# EAGLE design e75-2g4m10s (EAGLE 9.6.2)
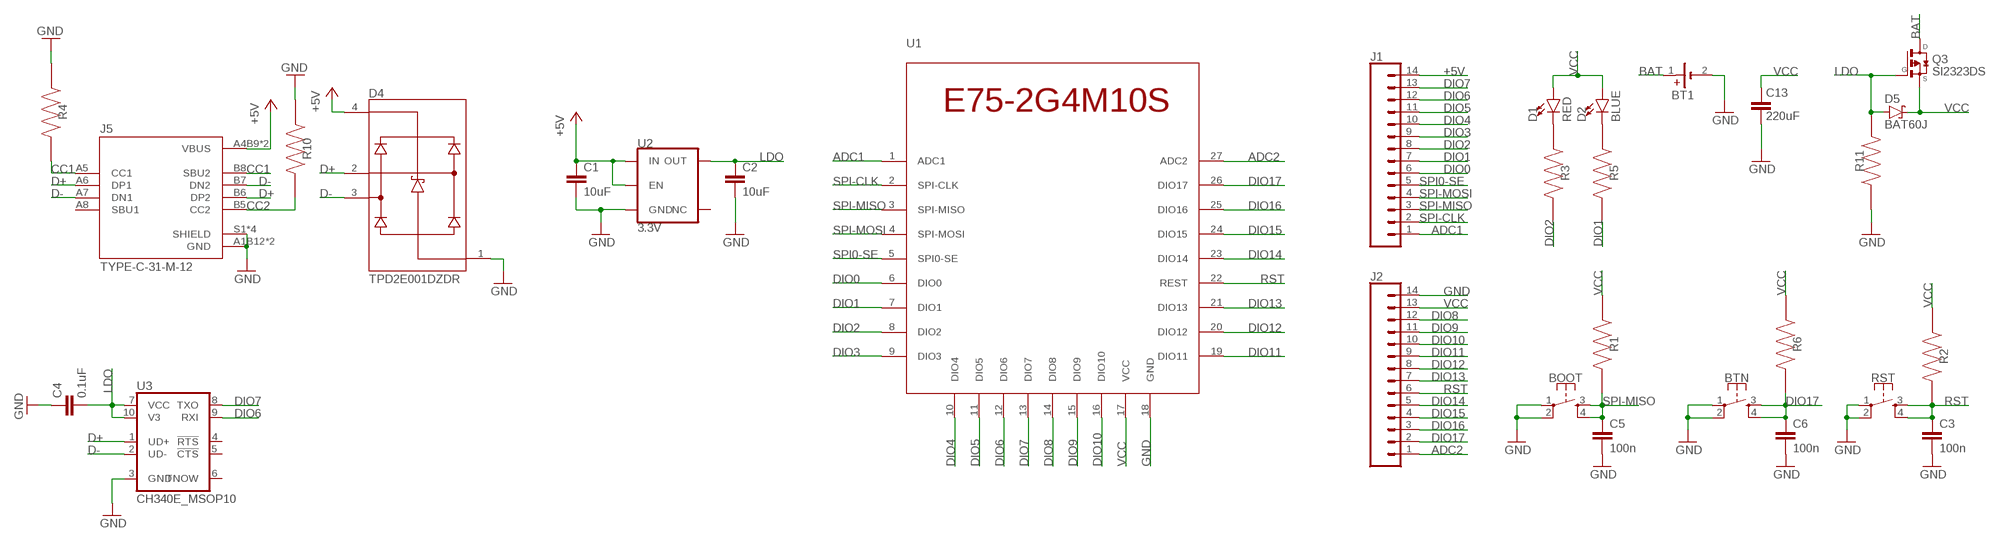
[diagram p0: schematic, sheet 1]

## Parts
BOOT  MOMENTARY-SWITCH-SPST-2-SMD-4.6X2.8MM  [TACTILE_SWITCH_SMD_4.6X2.8MM]
BT1  79527141  [79527141]
BTN  MOMENTARY-SWITCH-SPST-2-SMD-4.6X2.8MM  [TACTILE_SWITCH_SMD_4.6X2.8MM]
C1  10uF  10UF-0603-6.3V-20%  [0603]
C2  10uF  10UF-0603-6.3V-20%  [0603]
C3  100n  0.1UF-0603-25V-5%  [0603]
C4  0.1uF  0.1UF-0603-25V-(+80/-20%)  [0603]
C5  100n  0.1UF-0603-25V-5%  [0603]
C6  100n  0.1UF-0603-25V-5%  [0603]
C13  220uF  C_TANTALUM-2917(7343-METRIC)  [CAPM7343X310]
D1  RED  LED-RED0603  [LED-0603]
D2  BLUE  LED-GREEN0603  [LED-0603]
D4  TPD2E001DZDR  [SOT192P237X122-4N]
D5  BAT60J  [SOD323_ST]
J1  CONN_14NO_SILK  [1X14_NO_SILK]
J2  CONN_14NO_SILK  [1X14_NO_SILK]
J5  TYPE-C-31-M-12  [HRO_TYPE-C-31-M-12]
Q3  SI2323DS  [SOT23]
R1  10k  RC0402FR-073M6L  [RESC1005X40N]
R2  10k  RC0402FR-073M6L  [RESC1005X40N]
R3  2k  RC0402FR-073M6L  [RESC1005X40N]
R4  5.1k  RC0402FR-073M6L  [RESC1005X40N]
R5  2k  RC0402FR-073M6L  [RESC1005X40N]
R6  10k  RC0402FR-073M6L  [RESC1005X40N]
R10  5.1k  RC0402FR-073M6L  [RESC1005X40N]
R11  10k  RC0402FR-073M6L  [RESC1005X40N]
RST  MOMENTARY-SWITCH-SPST-2-SMD-4.6X2.8MM  [TACTILE_SWITCH_SMD_4.6X2.8MM]
U1  E73-2G4M04S1BE75-2G4M10S  [E75-2G4M10S]
U2  3.3V  V_REG_AP2112K-3.3V  [SOT23-5]
U3  CH340E_MSOP10  [MSOP10]

## Nets
+5V: C1.1 D4.4(VCC) J1.14 J5.A4B9(VBUS) J5.B4A9(VBUS) U2.1(IN) U2.3(EN)
ADC1: J1.1 U1.1(ADC1)
ADC2: J2.1 U1.27(ADC2)
BAT: BT1.1(+) Q3.3(D)
CC1: J5.A5(CC1) J5.B8(SBU2) R4.2
CC2: J5.B5(CC2) R10.2
D+: D4.2(IO1) J5.A6(DP1) J5.B6(DP2) U3.1(UD+)
D-: D4.3(IO2) J5.A7(DN1) J5.B7(DN2) U3.2(UD-)
DIO0: J1.6 U1.6(DIO0)
DIO1: J1.7 R5.2 U1.7(DIO1)
DIO2: J1.8 R3.2 U1.8(DIO2)
DIO3: J1.9 U1.9(DIO3)
DIO4: J1.10 U1.10(DIO4)
DIO5: J1.11 U1.11(DIO5)
DIO6: J1.12 U1.12(DIO6) U3.9(RXI)
DIO7: J1.13 U1.13(DIO7) U3.8(TXO)
DIO8: J2.12 U1.14(DIO8)
DIO9: J2.11 U1.15(DIO9)
DIO10: J2.10 U1.16(DIO10)
DIO11: J2.9 U1.19(DIO11)
DIO12: J2.8 U1.20(DIO12)
DIO13: J2.7 U1.21(DIO13)
DIO14: J2.5 U1.23(DIO14)
DIO15: J2.4 U1.24(DIO15)
DIO16: J2.3 U1.25(DIO16)
DIO17: BTN.3 BTN.4 C6.1 J2.2 R6.2 U1.26(DIO17)
GND: BOOT.1 BOOT.2 BT1.2(-) BTN.1 BTN.2 C1.2 C2.2 C3.2 C4.1 C5.2 C6.2 C13.2 D4.1(GND) J2.14 J5.A1B12(GND) J5.B1A12(GND) J5.S1(SHIELD) J5.S2(SHIELD) J5.S3(SHIELD) J5.S4(SHIELD) R4.1 R10.1 R11.1 RST.1 RST.2 U1.18(GND) U2.2(GND) U3.3(GND)
LDO: C2.1 C4.2 D5.A Q3.1(G) R11.2 U2.5(OUT) U3.7(VCC) U3.10(V3)
N$1: D1.C R3.1
N$4: D2.C R5.1
RST: C3.1 J2.6 R2.2 RST.3 RST.4 U1.22(REST)
SPI0-SE: J1.5 U1.5(SPI0-SE)
SPI-CLK: J1.2 U1.2(SPI-CLK)
SPI-MISO: BOOT.3 BOOT.4 C5.1 J1.3 R1.2 U1.3(SPI-MISO)
SPI-MOSI: J1.4 U1.4(SPI-MOSI)
VCC: C13.1 D1.A D2.A D5.C J2.13 Q3.2(S) R1.1 R2.1 R6.1 U1.17(VCC)
Unconnected: J5.A8(SBU1) U2.4(NC) U3.4(!RTS) U3.5(!CTS) U3.6(TNOW)

## Library data of the parts
BOOT BTN RST = SparkFun-Switches:MOMENTARY-SWITCH-SPST-2: Momentary Switch (Pushbutton) - SPST - Two Circuits Normally-open (NO) SPST momentary switches (buttons, pushbuttons). Schematic symbol includes two switch circuits. Variants SMD-4.6MMX2.8MM - 4.60mm x 2.80mm Tactile Momentary Button Switch - Used on SparkFun SAMD21 Mini Breakout <https://www.sparkfun.com/products/13664> SMD-5.2MM - Mini Pushbutton Switch - SMD <https://www.sparkfun.com/products/8720> - Used on Arduino Pro Mini <https://www.sparkfun.com/products/11114>; PROD_ID: SWCH-13065
BT1 = Battery Holder_2:79527141: BATTERY HOLDER COIN 20MM SMD Manufacturer's datasheet <https://katalog.we-online.de/em/datasheet/79527141.pdf>; CREATED_BY: PCBLayout.com; DIGIKEY_PART_NO: 732-12325-2-ND; MANUFACTURER: Wurth Electronics Inc.; MPN: 79527141
C1 C2 = SparkFun-Capacitors:10UF: 10.0µF ceramic capacitors A capacitor is a passive two-terminal electrical component used to store electrical energy temporarily in an electric field.; PROD_ID: CAP-11015
C3 C5 C6 = SparkFun-Capacitors:0.1UF: 0.1µF ceramic capacitors A capacitor is a passive two-terminal electrical component used to store electrical energy temporarily in an electric field.; PROD_ID: CAP-08604; VALUE: 0.1uF
C4 = SparkFun-Capacitors:0.1UF: 0.1µF ceramic capacitors A capacitor is a passive two-terminal electrical component used to store electrical energy temporarily in an electric field.; PROD_ID: CAP-00810
C13 = Capacitor:C: Capacitor - Generic; CATEGORY: Capacitor
D1 = SparkFun-LED:LED-RED: Red SMD LED Used in manufacturing of most products at SparkFun Packages: 0603 - SMD 0603 package [Product Link] <http://docs.avagotech.com/docs/AV02-0551EN> 0603 SMART - SMD 0603 SMART package ( more efficient and expensive)[Product Link] <http://www.osram-os.com/Graphics/XPic2/00077099_0.pdf> 1206 - SMD1206 package [Product Link] <https://www.sparkfun.com/datasheets/DevTools/LilyPad/Q150OVS4.pdff> SparkFun Products: Pro Mini 328 -5V <https://www.sparkfun.com/products/821> RedBoard <https://www.sparkfun.com/products/12757> IOIO-OTG <https://www.sparkfun.com/products/13613>; PROD_ID: DIO-00819
D2 = SparkFun-LED:LED-GREEN: Green SMD LED Used in manufacturing of various products at SparkFun Packages: 0603 - SMD 0603 package [Product Link] <http://www.futureelectronics.com/en/technologies/semiconductors/optoelectronics/leds/Pages/9894312-LTST-C190GKT.aspx?CrossPart=HSMG-C190&IM=0> LilyPad 1206 - SMD1206 LilyPad package [Product Link] <http://www.futureelectronics.com/en/Technologies/Product.aspx?ProductID=IN150NGHARVATEKCORPORATION2049943&IM=0> 1206 - SMD1206 package [Product Link] <http://www.futureelectronics.com/en/technologies/semiconductors/optoelectronics/leds/Pages/8315665-LTST-C150KGKT.aspx?IM=0> 1206 Bottom Mount -SMD 1206 Bottom Mount [Product Link] <http://www.digikey.com/product-detail/en/lite-on-inc/LTST-C230KGKT/160-1456-1-ND/386854> SparkFun Products: Pro Mini 328 -5V <https://www.sparkfun.com/products/821> RedBoard <https://www.sparkfun.com/products/12757> MP3 Trigger <https://www.sparkfun.com/products/13720> Makey Makey <https://www.sparkfun.com/products/11076>; PROD_ID: DIO-00821; VALUE: GREEN
D4 = TPD2E001DZDR:TPD2E001DZDR: Low-capacitance 2-channel +/-15k-V ESD protection array for high-speed data interfaces Check prices <https://pricing.snapeda.com/parts/TPD2E001DZDR/Texas%20Instruments/view-part?ref=eda>; AVAILABILITY: In Stock; DESCRIPTION: Low-capacitance 2-channel +/-15k-V ESD protection array for high-speed data interfaces 4-SOT-23 -40 to 85; MF: Texas Instruments; MP: TPD2E001DZDR; PACKAGE: SOT-23-4 Texas Instruments; PRICE: None; PURCHASE-URL: https://pricing.snapeda.com/search/part/TPD2E001DZDR/?ref=eda
D5 = diode:BAT60J: Schottky barrier diode Source: www.st.com, BAT60J.pdf
J1 J2 = SparkFun-Connectors:CONN_14: Multi connection point. Often used as Generic Header-pin footprint for 0.1 inch spaced/style header connections On any of the 0.1 inch spaced packages, you can populate with these: Break Away Headers - Straight <https://www.sparkfun.com/products/116> (PRT-00116) Break Away Male Headers - Right Angle <https://www.sparkfun.com/products/553> (PRT-00553) Female Headers <https://www.sparkfun.com/products/115> (PRT-00115) Break Away Headers - Machine Pin <https://www.sparkfun.com/products/117> (PRT-00117) Break Away Female Headers - Swiss Machine Pin <https://www.sparkfun.com/products/743> (PRT-00743) For SCREWTERMINALS and SPRING TERMINALS visit here: Screw Terimnals on SparkFun.com <https://www.sparkfun.com/search/results?term=Screw+Terminals> (5mm/3.5mm/2.54mm spacing) This device is also useful as a general connection point to wire up your design to another part of your project. Our various solder wires solder well into these plated through hole pads. Hook-Up Wire - Assortment (Stranded, 22 AWG) <https://www.sparkfun.com/products/11375> (PRT-11375) Hook-Up Wire - Assortment (Solid Core, 22 AWG) <https://www.sparkfun.com/products/11367> (PRT-11367) View the entire wire category on our website here <https://www.sparkfun.com/categories/141> Special notes: Molex polarized connector foot print use with SKU : PRT-08231 with associated crimp pins and housings. 1MM SMD Version SKU: PRT-10208 NOTES ON THE VARIANTS LOCK and LOCK_LONGPADS... This footprint was designed to help hold the alignment of a through-hole component (i.e. 6-pin header) while soldering it into place. You may notice that each hole has been shifted either up or down by 0.005 of an inch from it's more standard position (which is a perfectly straight line). This slight alteration caused the pins (the squares in the middle) to touch the edges of the holes. Because they are alternating, it causes a "brace" to hold the component in place. 0.005 has proven to be the perfect amount of "off-center" position when using our standard breakaway headers. Although looks a little odd when you look at the bare footprint, once you have a header in there, the alteration is very hard to notice. Also,if you push a header all the way into place, it is covered up entirely on the bottom side.
J5 = TYPE-C-31-M-12:TYPE-C-31-M-12: USB Connectors 24 Receptacle 1 8.94*7.3mm RoHS; AVAILABILITY: Unavailable; DESCRIPTION: USB Connectors 24 Receptacle 1 8.94*7.3mm RoHS; MF: HRO Electronics Co., Ltd.; MP: TYPE-C-31-M-12; PACKAGE: Package; PRICE: None
Q3 = SI2323DS:SI2323DS: P-Channel MOSFET; AVAILABILITY: Unavailable; DESCRIPTION: P-Channel 20V 3.7A (Ta) 750mW (Ta) Surface Mount SOT-23-3 (TO-236); MF: Vishay Siliconix; MP: SI2323DS; PACKAGE: SOT-23-3 Vishay Siliconix; PRICE: None
R1-R6 R10 R11 = RC0402FR-073M6L:RC0402FR-073M6L: RESISTOR, 0402 0.063W 1% 3M6; Resistance:3.6Mohm; Resistance Tolerance:± 1%; Power Rating:0.063W; Voltage Rating:50V; Series:RC32H; Temperature Coefficient:± 100ppm/°C; Resistor Element Type:Thick Film; Resistor Case Style:0402; No. of Pins:2; SVHC:No SVHC; Case Style:0402; External Length / Height:1mm; Temperature Coeff. +:100ppm/°C; Temperature Coeff. -:100ppm/°C; External Depth:0.35mm; External Width:0.5mm; Operating Temperature Range:-55°C to +155°C; Overload Voltage:100V Check prices <https://pricing.snapeda.com/parts/RC0402FR-073M6L/Yageo/view-part?ref=eda>; AVAILABILITY: Good; DESCRIPTION: RESISTOR, 0402 0.063W 1% 3M6; Resistance:3.6Mohm; Resistance Tolerance:± 1%; Power Rating:0.063W; Voltage Rating:50V; Series:RC32H; Temperature Coefficient:± 100ppm/°C; Resistor Element Type:Thick Film; Resistor Case Style:0402; No. of Pins:2; SVHC:No SVHC; Case Style:0402; External Length / Height:1mm; Temperature Coeff. +:100ppm/°C; Temperature Coeff. -:100ppm/°C; External Depth:0.35mm; External Width:0.5mm; Operating Temperature Range:-55°C to +155°C; Overload Voltage:100V; MF: Yageo; MP: RC0402FR-073M6L; PACKAGE: 1005 Panasonic Electronic Components; PRICE: None; PURCHASE-URL: https://pricing.snapeda.com/search/part/RC0402FR-073M6L/?ref=eda
U1 = E75-2G4M10S:E73-2G4M04S1B
U2 = SparkFun-IC-Power:V_REG_AP2112: AP2112 - 600mA CMOS LDO Regulator w/ Enable The AP2112 is CMOS process low dropout linear regulator with enable function, the regulator delivers a guaranteed 600mA (min.) continuous load current. Features Output Voltage Accuracy: ±1.5% Output Current: 600mA (Min.) Foldback Short Current Protection: 50mA Enable Function to Turn ON/OFF VOUT Low Dropout Voltage (3.3V): 250mV (Typ.) @IOUT=600mA Excellent Load Regulation: 0.2%/A (Typ.) Excellent Line Regulation: 0.02%/V (Typ.) Low Quiescent Current: 55μA (Typ.) Low Standby Current: 0.01μA (Typ.) Low Output Noise: 50μVRMS PSRR: 100Hz -65dB, 1kHz -65dB OTSD Protection Stable with 1.0μF Flexible Cap: Ceramic, Tantalum and Aluminum Electrolytic Operation Temperature Range: -40°C to 85°C ESD: MM 400V, HBM 4000V; PROD_ID: VREG-12457
U3 = CH340E:CH340E: Check prices <https://pricing.snapeda.com/parts/CH340E/WCH/view-part?ref=eda>; AVAILABILITY: Not in stock; DESCRIPTION: USB to serial chip CH340; MF: WCH; MP: CH340E; PACKAGE: Package; PRICE: None

## Net classes
0 default: clearance 0.205 mm

## Board
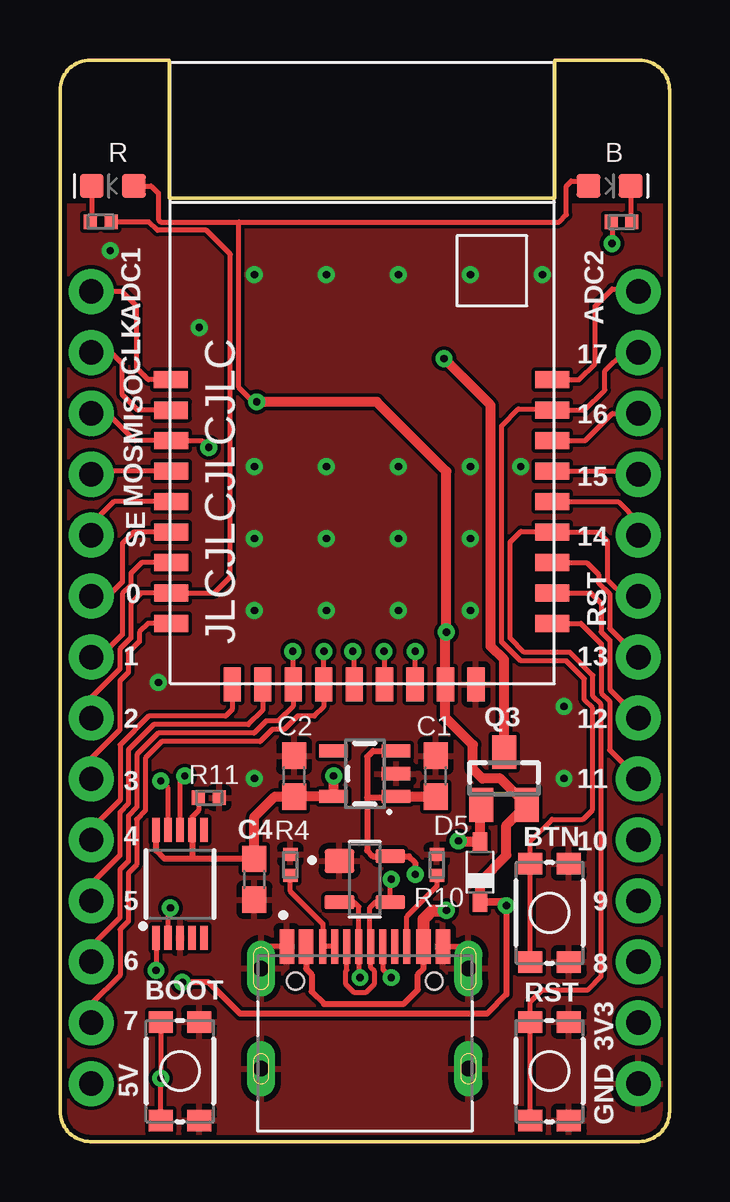
[diagram p1: board, top side]
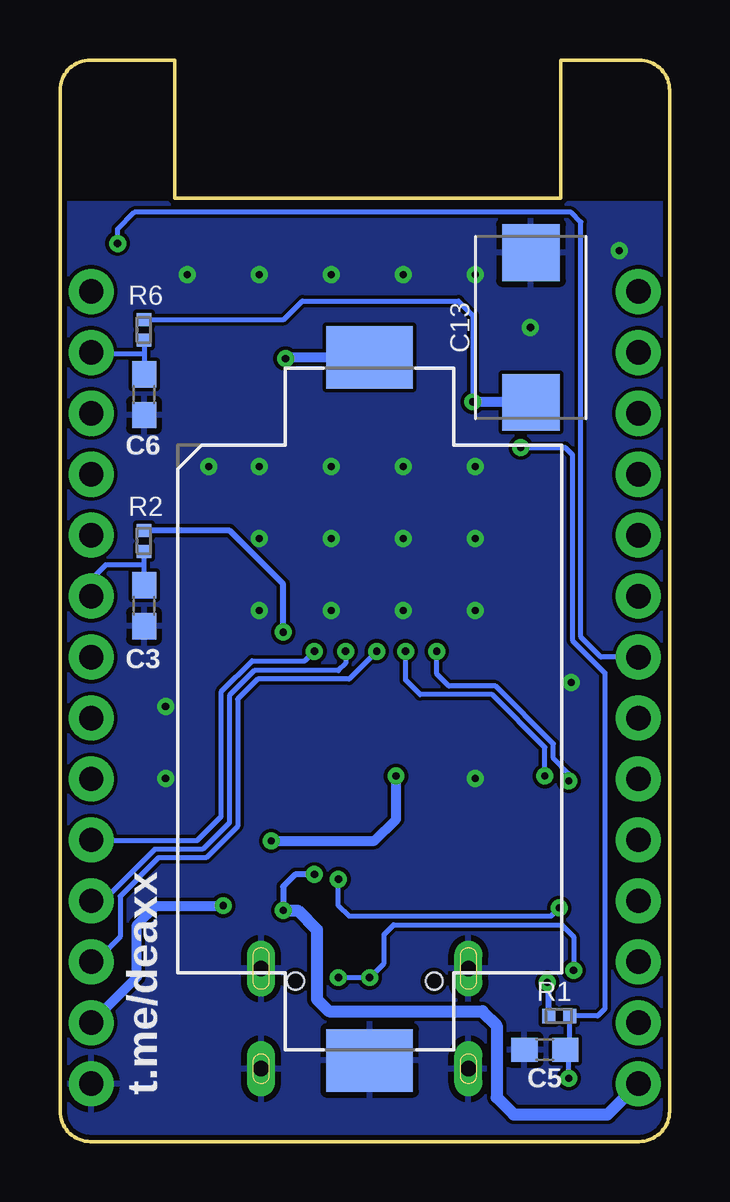
[diagram p2: board, bottom side, seen from below]

Size 25.4 x 45.09 mm. Coordinates in mm from the lower left corner, seen from the top.
Outline: 25.4,1.27 25.4,43.82 arc90 24.13,45.09 20.62,45.09 20.62,39.34 4.54,39.34 4.54,45.09 1.27,45.09 arc90 0,43.82 0,1.27 arc90 1.27,0 24.13,0 arc90 25.4,1.27
Copper layers (1*16): Top 0.035mm / dielectric 1.5mm / Bottom 0.035mm
Design rules "default *": minimum track width 0.2mm, minimum drill 0.3mm, track to track 6mil, track to pad 6mil, pad to pad 6mil, via to via 6mil, smd to smd 6mil, copper to edge 0.2mm, drill to drill 0.3mm, minimum pad ring 10mil, minimum via ring 8mil, stop-mask expansion 4mil, vias tented up to drill 0.3mm, thermal gap 10mil

### Footprints (pad centres in the part's own frame; a part is rotated, then mirrored left to right if it is on the bottom)
TACTILE_SWITCH_SMD_4.6X2.8MM = smd 0.9 x 1: 1 -2.05,-0.8; 2 2.05,-0.8; 3 2.05,0.8; 4 -2.05,0.8
79527141 = smd 2.6 x 3.6: 1 -14.65,0; 2 14.65,0
0603 = smd 1.1 x 1: 1 -0.85,0; 2 0.85,0
CAPM7343X310 = smd 2.368 x 2.404: 1 -3.121,0; 2 3.121,0
LED-0603 = smd 1 x 1: A -0.877,0; C 0.877,0
SOT192P237X122-4N = smd 1.24 x 0.99: 1 -1.055,0.76 | smd 1.24 x 0.59: 2 -1.055,-0.96; 3 1.055,-0.96; 4 1.055,0.96
SOD323_ST = smd 0.8 x 0.6: A 1.25,0; C -1.25,0
1X14_NO_SILK = drill 1.016 pad 1.88: 1 0,0; 2 2.54,0; 3 5.08,0; 4 7.62,0; 5 10.16,0; 6 12.7,0; 7 15.24,0; 8 17.78,0; 9 20.32,0; 10 22.86,0; 11 25.4,0; 12 27.94,0; 13 30.48,0; 14 33.02,0
HRO_TYPE-C-31-M-12 = smd 0.6 x 1.45: A1B12 -3.25,5.095; A4B9 -2.45,5.095; B1A12 3.25,5.095; B4A9 2.45,5.095 | smd 0.3 x 1.45: A5 -1.25,5.095; A6 -0.25,5.095; A7 0.25,5.095; A8 1.25,5.095; B5 1.75,5.095; B6 0.75,5.095; B7 -0.75,5.095; B8 -1.75,5.095 | drill 0.65 pad 1.05 long: S1 -4.32,4.18; S2 4.32,4.18; S3 -4.32,0; S4 4.32,0 | hole 0.7: -2.89,3.65; 2.89,3.65
SOT23 = smd 1 x 1.4: 1 -0.95,-1.1; 2 0.95,-1.1; 3 0,1.1
RESC1005X40N = smd 0.54 x 0.6: 1 -0.432,0; 2 0.432,0
E75-2G4M10S = smd 1.422 x 0.711: 1 -7.988,0.222; 2 -7.968,-1.048; 3 -7.968,-2.318; 4 -7.968,-3.588; 5 -7.968,-4.858; 6 -7.968,-6.128; 7 -7.968,-7.398; 8 -7.968,-8.668; 9 -7.968,-9.938; 19 7.907,-9.938; 20 7.907,-8.668; 21 7.907,-7.398; 22 7.907,-6.128; 23 7.907,-4.858; 24 7.907,-3.588; 25 7.907,-2.318; 26 7.907,-1.048; 27 7.907,0.222 | smd 0.711 x 1.422: 10 -5.428,-12.478; 11 -4.158,-12.478; 12 -2.888,-12.478; 13 -1.618,-12.478; 14 -0.348,-12.478; 15 0.922,-12.478; 16 2.192,-12.478; 17 3.462,-12.478; 18 4.732,-12.478
SOT23-5 = smd 0.55 x 1.2: 1 -0.95,-1.3; 2 0,-1.3; 3 0.95,-1.3; 4 0.95,1.3; 5 -0.95,1.3
MSOP10 = smd 1 x 0.3: 1 -2.25,1; 2 -2.25,0.5; 3 -2.25,0; 4 -2.25,-0.5; 5 -2.25,-1; 6 2.25,-1; 7 2.25,-0.5; 8 2.25,0; 9 2.25,0.5; 10 2.25,1

### Placement (x,y rotation side)
BOOT  5,2.94 90 top
BT1  12.5,18.04 270 bottom
BTN  20.4,9.54 90 top
C1  15.65,15.24 90 top
C2  9.75,15.24 90 top
C3  21.9,22.33 270 bottom
C4  8.1,10.94 90 top
C5  5.2,3.83 180 bottom
C6  21.9,31.13 270 bottom
C13  5.78,33.94 90 bottom
D1  2.2,39.84 180 top
D2  22.9,39.84 0 top
D4  12.7,10.94 0 top
D5  17.5,11.24 90 top
J1  1.3,35.44 270 top
J2  24.1,35.44 270 top
J5  12.7,3.04 0 top
Q3  18.5,15.13 0 top
R1  4.6,5.23 0 bottom
R2  21.9,25.04 270 bottom
R3  1.7,38.34 0 top
R4  9.6,11.54 270 top
R5  23.4,38.34 180 top
R6  21.9,33.84 270 bottom
R10  15.7,11.54 270 top
R11  6.2,14.34 180 top
RST  20.4,2.94 90 top
U1  12.6,31.54 0 top
U2  12.7,15.34 90 top
U3  5,10.74 90 top

### Tracks (layer width: path | path; a pad name or v marks a point on that pad's centre or on a via)
+5V  (via drill 0.3)
  Top 0.254: J5.A4B9 10.25,7.2 10.49,6.96 10.49,6.25 11,5.73 14.31,5.73 14.91,6.33 14.91,6.96 15.15,7.2 J5.B4A9 | U2.3 13.05,16.29 12.8,16.04 12.8,14.34 | 12.8,14.34 12.8,12.13 13.04,11.9 D4.4 14.54,11.9 14.8,11.63 v14.8,11.13 | U2.1 13.95,14.34 12.8,14.34
  Top 0.406: U2.1 C1.1
  Top 0.508: J5.B4A9 15.15,9.28 15.3,9.43 15.31,9.43 15.52,9.63 v16.1,9.63
  Bottom 0.254: v14.8,11.13 15.6,11.13 16.1,10.63 v16.1,9.63
  Bottom 0.508: v16.1,9.63 15.5,9.63 14.7,8.84 14.7,5.93 14.2,5.43 7.8,5.43 7.21,4.84 7.21,1.84 6.5,1.14 2.58,1.14 J1.14
ADC1
  Top 0.2: U1.1 3.68,31.76 3.2,32.23 3.2,34.84 2.6,35.44 J1.1
ADC2
  Top 0.2: J2.1 24,35.54 23,35.54 22.3,34.84 22.3,32.44 21.62,31.76 U1.27
BAT  (via drill 0.3)
  Top 0.406: Q3.3 18.5,20.09 17.94,20.65 17.94,30.69 v16,32.64
  Bottom 0.406: BT1.1 15.95,32.69 v16,32.64
CC1
  Top 0.2: J5.A5 J5.B8 10.95,9.09 9.6,10.44 R4.2
CC2
  Top 0.2: J5.B5 14.45,9.38 15.7,10.63 R10.2
D+  (via drill 0.3)
  Top 0.2: v12.5,6.83 12.45,6.88 J5.A6 12.45,9.79 12.26,9.97 D4.2 | J5.B6 13.46,8.12 13.46,7.18 v13.8,6.83 | U3.1 v4,7.13
  Bottom 0.2: v13.8,6.83 v12.5,6.83 11.9,7.43 11.9,8.63 11.5,9.04 4.5,9.04 4,8.54 v4,7.13
D-  (via drill 0.3)
  Top 0.2: J5.B7 11.95,7.14 11.89,7.09 11.89,6.58 12.25,6.23 12.75,6.23 13.11,6.58 13.11,7.09 12.95,7.24 J5.A7 12.9,8.18 12.9,9.74 13.14,9.97 D4.3 13.75,10.89 v13.8,10.94 | U3.2 4.5,9.63 v4.6,9.74
  Bottom 0.2: v4.6,9.74 4.95,9.39 13.35,9.39 13.8,9.84 v13.8,10.94
DIO0
  Top 0.2: U1.6 3.07,25.41 2.6,24.93 2.6,23.33 2,22.73 J1.6
DIO1  (via drill 0.3)
  Top 0.2: U1.7 3.4,24.14 2.95,23.69 2.95,23.19 2.6,22.84 2.6,21.13 1.66,20.2 J1.7 | R5.2 23,38.3 v23,37.44
  Bottom 0.2: J1.7 2.86,20.2 3.7,21.04 3.7,38.34 4.1,38.73 22.3,38.73 23,38.04 v23,37.44
DIO2
  Top 0.2: J1.8 1.3,18.51 2.49,19.7 2.49,20.53 2.95,20.99 2.95,22.43 3.38,22.87 U1.8 6.43,22.87 7.1,23.54 7.1,36.98 6.1,37.98 4.05,37.98 3.7,38.34 R3.2
DIO3
  Top 0.2: U1.9 3.67,21.6 3.31,21.23 3.31,20.84 2.85,20.38 2.85,19.55 2.49,19.2 2.49,17.16 1.3,15.97 J1.9
DIO4
  Top 0.2: U1.10 7.17,18.01 6.9,17.73 3.7,17.73 2.5,16.54 2.5,14.24 1.3,13.04 J1.10
DIO5
  Top 0.2: U1.11 8.44,17.98 7.85,17.38 3.9,17.38 2.85,16.33 2.85,14.09 2.49,13.73 2.49,11.93 1.3,10.74 J1.11
DIO6  (via drill 0.3)
  Top 0.2: J1.12 1.3,8.13 2.49,9.33 2.49,11.33 2.85,11.68 2.85,13.58 3.21,13.94 3.21,16.13 4.1,17.03 8.09,17.03 8.6,17.54 9.1,17.54 9.71,18.15 U1.12 9.71,20.42 v9.7,20.43 | U3.9 4.5,14.74 v4.2,15.04
  Bottom 0.2: v4.2,15.04 4.2,15.34 4.85,15.98 4.85,16.58 7.25,18.99 9.2,18.99 9.7,19.49 v9.7,20.43
DIO7  (via drill 0.3)
  Top 0.2: J1.13 1.3,5.73 2.5,6.93 2.5,8.84 2.85,9.18 2.85,11.18 3.2,11.53 3.2,13.44 3.56,13.8 3.56,15.99 4.25,16.68 8.34,16.68 8.84,17.18 9.35,17.18 9.9,17.73 10.6,17.73 10.98,18.12 U1.13 10.98,20.42 v11,20.43 | U3.8 5,15.04 v5.2,15.24
  Bottom 0.2: v5.2,15.24 5.2,16.43 7.4,18.63 10.4,18.63 11,19.23 v11,20.43
DIO8  (via drill 0.3)
  Top 0.2: U1.14 12.25,20.38 v12.2,20.43
  Bottom 0.2: v12.2,20.43 13.35,19.28 17.16,19.28 18,18.44 18,13.14 19.31,11.83 21.3,11.83 22.9,10.23 22.9,8.54 23.94,7.49 J2.12
DIO9  (via drill 0.3)
  Top 0.2: U1.15 13.52,20.41 v13.5,20.43
  Bottom 0.2: v13.5,20.43 13.5,19.93 13.8,19.63 17.3,19.63 18.35,18.59 18.35,13.29 19.45,12.18 21.45,12.18 23.6,10.04 J2.11
DIO10  (via drill 0.3)
  Top 0.2: U1.16 v14.79,20.43 v14.8,20.43
  Bottom 0.2: v14.8,20.43 15.2,20.04 17.4,20.04 18.7,18.73 18.7,13.54 19.7,12.54 24.06,12.54 J2.10
DIO11
  Top 0.2: U1.19 21.7,21.6 22.55,20.74 22.55,18.7 22.9,18.36 22.9,16.31 J2.9
DIO12
  Top 0.2: U1.20 22.12,22.87 22.55,22.43 22.55,21.25 22.91,20.89 22.91,18.85 J2.8
DIO13
  Top 0.2: U1.21 21.95,24.14 22.45,23.63 22.45,23.29 22.9,22.84 22.9,21.39 J2.7
DIO14
  Top 0.2: U1.23 23.26,26.68 24.1,25.83 J2.5
DIO15
  Top 0.2: U1.24 23.97,27.95 J2.4
DIO16
  Top 0.2: U1.25 21.88,29.22 23.02,30.36 J2.3
DIO17
  Top 0.2: U1.26 20.7,30.49 | 20.7,30.49 21.85,30.49 22.7,31.33 22.7,32.14 23.46,32.9 J2.2 | 20.7,30.49 20.65,30.54 19.1,30.54 18.4,29.83 18.4,20.83 19.2,20.04 21.1,20.04 21.85,19.29 21.85,18.41 22.2,18.06 22.2,13.83 21.8,13.44 20.5,13.44 19.6,12.54 BTN.3 BTN.4
  Bottom 0.2: R6.2 21.9,32.84 | 21.9,32.84 C6.1 | 21.9,32.84 24.04,32.84 J2.2
GND  (via drill 0.3)
  Top 0.2: J5.B1A12 16.8,8.13 17.02,7.92 J5.S2 | J5.A1B12 8.69,8.13 8.3,7.73 8.3,7.29 J5.S1
  Top 0.406: J5.A1B12
  other vias: 8.1,28.13 14.1,28.13 11.1,28.13 8.1,25.13 8.1,22.13 11.1,25.13 11.1,22.13 14.1,25.13 14.1,22.13 8.1,36.14 11.1,36.14 14.1,36.14 17.1,36.14 20.1,36.14 21,18.13 21,15.13 8.1,15.13 4.1,19.13 2.1,37.14 5.8,33.94 19.2,28.13 17.1,22.13 17.1,25.13 17.1,28.13
  pour Top: -0.2,39.04 -0.2,-0.67 25.9,-0.67 25.9,39.04
  pour Bottom: -0.4,39.14 -0.4,-0.47 25.7,-0.47 25.7,39.14
LDO  (via drill 0.3)
  Top 0.2: U3.7 5.5,13.54 5.8,13.84 5.8,14.3 R11.2
  Top 0.254: C4.2 5.5,11.79 | 5.5,11.79 4.35,11.79 4,12.13 U3.10 | U3.7 5.5,11.79
  Top 0.406: Q3.1 17.5,13.99 D5.A 16.65,12.49 v16.6,12.54 | C4.2 8.1,13.54 8.95,14.38 C2.1 U2.5 v11.4,15.24 | v11.4,15.24
  Bottom 0.406: v16.6,12.54 12.3,12.54 11.4,13.44 v11.4,15.24
N$1
  Top 0.2: R3.1 1.32,38.39 D1.C
N$4
  Top 0.2: D2.C 23.78,38.39 R5.1
RST
  Top 0.2: U1.22 20.6,25.41 | 20.6,25.41 22.43,25.41 22.8,25.04 22.8,23.43 23.5,22.73 J2.6 | RST.4 RST.3 19.6,5.83 20.1,6.33 22,6.33 22.55,6.88 22.55,18.21 22.2,18.55 22.2,19.43 21.25,20.39 19.35,20.39 18.75,20.98 18.75,24.99 19.2,25.43 20.57,25.43 20.6,25.41
  Bottom 0.2: C3.1 21.9,24.04 | 21.9,24.04 R2.2 | 21.9,24.04 23.5,24.04 24.1,23.43 J2.6
SPI0-SE
  Top 0.2: U1.5 2.24,26.68 1.3,25.73 J1.5
SPI-CLK
  Top 0.2: U1.2 3.25,30.49 2.6,31.13 2.6,32.44 2.14,32.9 J1.2
SPI-MISO  (via drill 0.3)
  Top 0.2: J1.3 1.98,30.36 3.12,29.22 U1.3 5.92,29.22 v6.2,28.93 | BOOT.4 v4.2,2.64 BOOT.3
  Bottom 0.2: v6.2,28.93 4.35,28.93 4.05,28.63 4.05,20.89 2.7,19.54 2.7,5.53 3,5.23 R1.2 4.17,4.02 C5.1 4.2,3.69 v4.2,2.64
SPI-MOSI
  Top 0.2: U1.4 1.43,27.95 J1.4
VCC  (via drill 0.3)
  Top 0.2: D1.A 3.8,39.84 4.1,39.54 4.1,38.44 4.2,38.34 7.45,38.34 | D2.A 21.82,40.04 21.3,40.04 21.1,39.84 21.1,38.64 20.8,38.34 7.45,38.34 | v8.2,30.83 8.05,30.83 7.45,31.43 7.45,38.34
  Top 0.254: v18.6,9.84 18.6,6.13 17.79,5.33 7.51,5.33 6.2,6.63 v5.1,6.63 | 16.06,21.2 v16.1,21.23
  Top 0.305: D5.C 18.45,9.99 v18.6,9.84
  Top 0.406: D5.C 17.5,10.84 18.6,11.94 18.6,13.19 Q3.2 18.35,15.13 17.6,15.13 17.2,15.54 17.2,16.54 16.06,17.67 U1.17 16.06,21.2 | v16.1,21.23 16.1,27.93 13.2,30.83 v8.2,30.83
  Bottom 0.2: R6.1 16.07,34.27 15.3,35.04 8.8,35.04 8.2,34.44 v8.2,30.83
  Bottom 0.254: R1.1 5.03,6.57 v5.1,6.63 | v16.1,21.23 16.1,23.23 18.33,25.47 R2.1
  Bottom 0.406: J2.13 22.2,6.85 22.2,9.04 21.4,9.84 v18.6,9.84 | C13.1 5.8,30.83 v8.2,30.83

### Text on the board
tNames: R | B | ADC1 | ADC2 | 17 | CLK | 16 | MISO | 15 | MOSI | 14 | SE | RST | 0 | JLCJLCJLCJLC | 13 | 1 | 12 | 2 | 11 | 3 | 10 | 4 | 9 | 5 | 8 | 6 | 3V3 | 7 | GND | 5V
bNames: t.me/deaxx